# Altium schematic sheet CATS-FAT-IMU.SchDoc: CATS Pro
size A4; Author: Luca Jost; Revision: 1.0; SheetNumber: 10; SheetTotal: 13; Subtitle: IMU
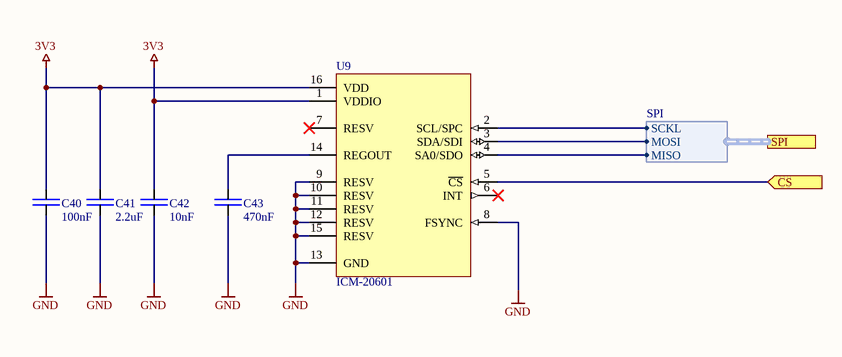
[diagram p0: CATS-FAT-IMU.SchDoc]

## Parts
C40  100nF  [SMD Keramikkondensator 0603]
C41  2.2uF  [SMD Keramikkondensator 0603]
C42  10nF  [SMD Keramikkondensator 0603]
C43  470nF  [SMD Keramikkondensator 0603]
U9  ICM-20601  [SMD IC LGA-16 5/3]

## Ports
CS (in), SPI (harness SPI)

## Harnesses
SPI: SCKL, MOSI, MISO

## Nets
3V3: C40.2 C41.2 C42.2 U9.1(VDDIO) U9.16(VDD)
GND: C40.1 C41.1 C42.1 C43.1 U9.8(FSYNC) U9.9(RESV) U9.10(RESV) U9.11(RESV) U9.12(RESV) U9.13(GND) U9.15(RESV)
CS: U9.5(~{CS}) ; port CS
NetC43_2: C43.2 U9.14(REGOUT)
NetU9_2: U9.2(SCL/SPC) ; port SPI.SCKL
NetU9_3: U9.3(SDA/SDI) ; port SPI.MOSI
NetU9_4: U9.4(SA0/SDO) ; port SPI.MISO

Not connected (* = marked no-connect by the designer): U9 6(INT)* 7(RESV)*

## Notes on the sheet
- Title
- Author:
- Subtitle
- Date:
- Rev:
- CATS
- Sheet
- of
- File:

## Library data of the parts
C40 = E6 - 100nF: SMD Ceramic Capacitor E6; Unit Price: 0.01; Number: -; Supplier: -
C41 = E6 - 2.2uF: SMD Ceramic Capacitor E6; Unit Price: 0.01; Number: -; Supplier: -
C42 = E6 - 10nF: SMD Ceramic Capacitor E6; Unit Price: 0.01; Number: -; Supplier: -
C43 = E6 - 470nF: SMD Ceramic Capacitor E6; Unit Price: 0.01; Number: -; Supplier: -
U9 = ICM-20601: World’s First Wide-Range 6-Axis MotionTracking Device for High Speed Applications /; ComponentLink1Description: Datasheet; ComponentLink1URL: https://www.invensense.com/wp-content/uploads/2015/12/DS-000184-ICM-20600-v1.0.pdf; Digikey: 1428-1058-1-ND